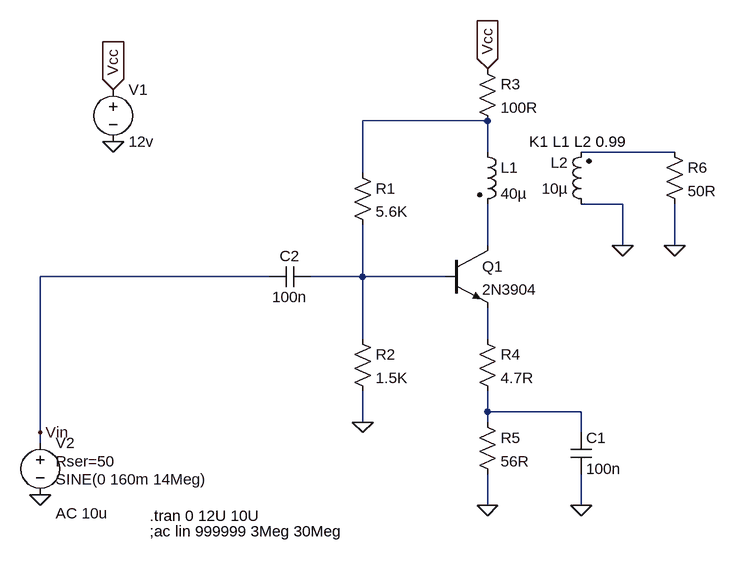
[diagram p0: schematic RF_OUT_PREAMP.asc]
RF_OUT_PREAMP.asc, the LTspice schematic file:
Version 4
SHEET 1 1284 680
WIRE -48 -368 -240 -368
WIRE -48 -320 -48 -368
WIRE 240 -320 96 -320
WIRE -240 -288 -240 -368
WIRE 160 -240 96 -240
WIRE -48 -176 -48 -240
WIRE 160 -176 160 -240
WIRE 240 -176 240 -240
WIRE -384 -128 -736 -128
WIRE -240 -128 -240 -208
WIRE -240 -128 -320 -128
WIRE -112 -128 -240 -128
WIRE -240 -32 -240 -128
WIRE -48 -32 -48 -80
WIRE -48 80 -48 48
WIRE 96 80 -48 80
WIRE -240 96 -240 48
WIRE -48 96 -48 80
WIRE -736 112 -736 -128
WIRE 96 112 96 80
WIRE -736 128 -736 112
WIRE -48 224 -48 176
WIRE 96 224 96 176
FLAG -736 208 0
FLAG -736 112 Vin
FLAG -240 96 0
FLAG 96 224 0
FLAG -48 224 0
FLAG -624 -336 0
FLAG -624 -416 Vcc
IOPIN -624 -416 In
FLAG -48 -448 Vcc
IOPIN -48 -448 In
FLAG 160 -176 0
FLAG 240 -176 0
SYMBOL voltage -736 112 R0
WINDOW 123 24 124 Left 2
WINDOW 39 24 44 Left 2
WINDOW 3 24 72 Left 2
SYMATTR Value2 AC 10u
SYMATTR SpiceLine Rser=50
SYMATTR Value SINE(0 160m 14Meg)
SYMATTR InstName V2
SYMBOL res -256 -304 R0
SYMATTR InstName R1
SYMATTR Value 5.6K
SYMBOL res -256 -48 R0
SYMATTR InstName R2
SYMATTR Value 1.5K
SYMBOL res -64 -48 R0
SYMATTR InstName R4
SYMATTR Value 4.7R
SYMBOL npn -112 -176 R0
SYMATTR InstName Q1
SYMATTR Value 2N3904
SYMBOL cap 80 112 R0
SYMATTR InstName C1
SYMATTR Value 100n
SYMBOL res -64 80 R0
SYMATTR InstName R5
SYMATTR Value 56R
SYMBOL ind2 -64 -336 R0
SYMATTR InstName L1
SYMATTR Value 40µ
SYMATTR Type ind
SYMBOL cap -320 -144 R90
WINDOW 0 0 32 VBottom 2
WINDOW 3 32 32 VTop 2
SYMATTR InstName C2
SYMATTR Value 100n
SYMBOL voltage -624 -432 R0
WINDOW 123 0 0 Left 0
WINDOW 39 0 0 Left 0
SYMATTR InstName V1
SYMATTR Value 12v
SYMBOL ind2 112 -224 R180
WINDOW 0 36 80 Left 2
WINDOW 3 36 40 Left 2
SYMATTR InstName L2
SYMATTR Value 10µ
SYMATTR Type ind
SYMBOL res 224 -336 R0
SYMATTR InstName R6
SYMATTR Value 50R
SYMBOL res -64 -464 R0
SYMATTR InstName R3
SYMATTR Value 100R
TEXT -568 264 Left 2 !;ac lin 999999 3Meg 30Meg
TEXT 16 -336 Left 2 !K1 L1 L2 0.99
TEXT -568 240 Left 2 !.tran 0 12U 10U

The netlist it stands for:
* RF_OUT_PREAMP.asc
V2 Vin 0 SINE(0 160m 14Meg) AC 10u Rser=50
R1 N001 N004 5.6K
R2 N004 0 1.5K
R4 N005 N006 4.7R
Q1 N003 N004 N005 0 2N3904
C1 N006 0 100n
R5 N006 0 56R
L1 N001 N003 40µ
C2 N004 Vin 100n
V1 Vcc 0 12v
L2 0 N002 10µ
R6 N002 0 50R
R3 Vcc N001 100R
.model NPN NPN
.model PNP PNP
.lib standard.bjt
;ac lin 999999 3Meg 30Meg
K1 L1 L2 0.99
.tran 0 12U 10U
.backanno
.end